# Altium schematic sheet bolid-inputs-digital.SchDoc
size A3
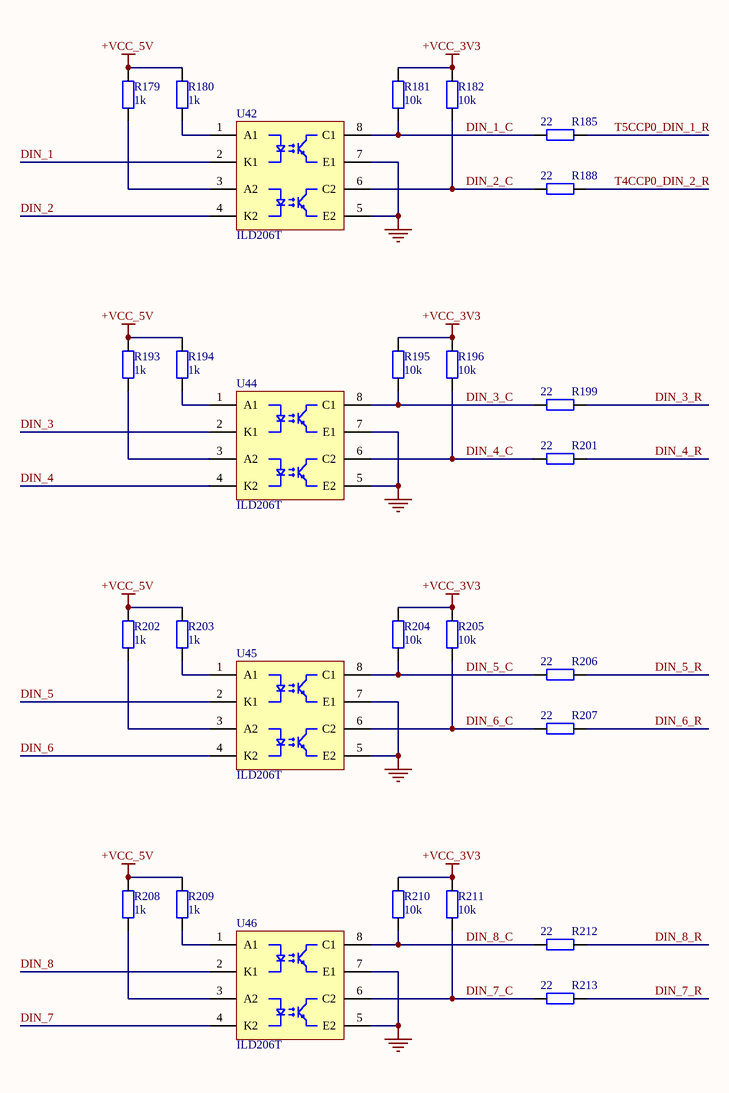
[diagram p0: bolid-inputs-digital.SchDoc]

## Parts
R179  value 1k  [R0402-RESC100X50X40L22N]  (hidden comment: RC0402FR-071KL)
R180  value 1k  [R0402-RESC100X50X40L22N]  (hidden comment: RC0402FR-071KL)
R181  value 10k  [R0402-RESC100X50X40L22N]  (hidden comment: RC0402FR-0710KL)
R182  value 10k  [R0402-RESC100X50X40L22N]  (hidden comment: RC0402FR-0710KL)
R185  value 22  [R0402-RESC100X50X40L22N]  (hidden comment: RC0402FR-1322RL)
R188  value 22  [R0402-RESC100X50X40L22N]  (hidden comment: RC0402FR-1322RL)
R193  value 1k  [R0402-RESC100X50X40L22N]  (hidden comment: RC0402FR-071KL)
R194  value 1k  [R0402-RESC100X50X40L22N]  (hidden comment: RC0402FR-071KL)
R195  value 10k  [R0402-RESC100X50X40L22N]  (hidden comment: RC0402FR-0710KL)
R196  value 10k  [R0402-RESC100X50X40L22N]  (hidden comment: RC0402FR-0710KL)
R199  value 22  [R0402-RESC100X50X40L22N]  (hidden comment: RC0402FR-1322RL)
R201  value 22  [R0402-RESC100X50X40L22N]  (hidden comment: RC0402FR-1322RL)
R202  value 1k  [R0402-RESC100X50X40L22N]  (hidden comment: RC0402FR-071KL)
R203  value 1k  [R0402-RESC100X50X40L22N]  (hidden comment: RC0402FR-071KL)
R204  value 10k  [R0402-RESC100X50X40L22N]  (hidden comment: RC0402FR-0710KL)
R205  value 10k  [R0402-RESC100X50X40L22N]  (hidden comment: RC0402FR-0710KL)
R206  value 22  [R0402-RESC100X50X40L22N]  (hidden comment: RC0402FR-1322RL)
R207  value 22  [R0402-RESC100X50X40L22N]  (hidden comment: RC0402FR-1322RL)
R208  value 1k  [R0402-RESC100X50X40L22N]  (hidden comment: RC0402FR-071KL)
R209  value 1k  [R0402-RESC100X50X40L22N]  (hidden comment: RC0402FR-071KL)
R210  value 10k  [R0402-RESC100X50X40L22N]  (hidden comment: RC0402FR-0710KL)
R211  value 10k  [R0402-RESC100X50X40L22N]  (hidden comment: RC0402FR-0710KL)
R212  value 22  [R0402-RESC100X50X40L22N]  (hidden comment: RC0402FR-1322RL)
R213  value 22  [R0402-RESC100X50X40L22N]  (hidden comment: RC0402FR-1322RL)
U42  ILD206T  [Vishay SOIC8 ILD SOIC8P127_600X610X395L51X41]
U44  ILD206T  [Vishay SOIC8 ILD SOIC8P127_600X610X395L51X41]
U45  ILD206T  [Vishay SOIC8 ILD SOIC8P127_600X610X395L51X41]
U46  ILD206T  [Vishay SOIC8 ILD SOIC8P127_600X610X395L51X41]

## Nets
+VCC_3V3: R181.2 R182.2 R195.2 R196.2 R204.2 R205.2 R210.2 R211.2
+VCC_5V: R179.2 R180.2 R193.2 R194.2 R202.2 R203.2 R208.2 R209.2
GND: U42.5(E2) U42.7(E1) U44.5(E2) U44.7(E1) U45.5(E2) U45.7(E1) U46.5(E2) U46.7(E1)
DIN_1: U42.2(K1)
DIN_1_C: R181.1 R185.1 U42.8(C1)
DIN_2: U42.4(K2)
DIN_2_C: R182.1 R188.1 U42.6(C2)
DIN_3: U44.2(K1)
DIN_3_C: R195.1 R199.1 U44.8(C1)
DIN_3_R: R199.2
DIN_4: U44.4(K2)
DIN_4_C: R196.1 R201.1 U44.6(C2)
DIN_4_R: R201.2
DIN_5: U45.2(K1)
DIN_5_C: R204.1 R206.1 U45.8(C1)
DIN_5_R: R206.2
DIN_6: U45.4(K2)
DIN_6_C: R205.1 R207.1 U45.6(C2)
DIN_6_R: R207.2
DIN_7: U46.4(K2)
DIN_7_C: R211.1 R213.1 U46.6(C2)
DIN_7_R: R213.2
DIN_8: U46.2(K1)
DIN_8_C: R210.1 R212.1 U46.8(C1)
DIN_8_R: R212.2
T4CCP0_DIN_2_R: R188.2
T5CCP0_DIN_1_R: R185.2
NetR179_1: R179.1 U42.3(A2)
NetR180_1: R180.1 U42.1(A1)
NetR193_1: R193.1 U44.3(A2)
NetR194_1: R194.1 U44.1(A1)
NetR202_1: R202.1 U45.3(A2)
NetR203_1: R203.1 U45.1(A1)
NetR208_1: R208.1 U46.3(A2)
NetR209_1: R209.1 U46.1(A1)

## Library data of the parts
R179 R180 R193 R194 R202 R203 R208 R209 = RC0402FR-071KL: RES 0402 (1005) 1.00k 1% 0.0625W 50V Thick Film; Manufacturer: Yageo; Power Rating: 62.5 mW, 125 mW; Resistance: 1 kOhms; Temperature Coefficient: 100 PPM / C; Supplier 1: Mouser; Manufacturer Part Number: RC0402FR-071KL; RoHS: RoHS Compliant; Category: Thick Film Resistors - SMD; Stock 1: 18776448; Pricing 1: 1=0.090, 10=0.011, 100=0.004, 1000=0.003, 10000=0.003 (EUR); Application: High Reliability; Features: -; Height: 0.35 mm; Length: 1 mm; Package / Case: -; Packaging: Cut Tape; Product: Thick Film Resistors SMD; Series: RC; Technology: Thick Film; Termination Style: SMD/SMT; Tolerance: 1 %; Type: General Purpose; Voltage Rating: 50 V; Width: 0.5 mm; Brand: Yageo; Mounting Style: PCB Mount; Case Code - in: 0402; Case Code - mm: 1005; Maximum Operating Temperature: + 155 C; Minimum Operating Temperature: - 55 C; Product Type: Thick Film Resistors; Standard Pack Qty: 10000; Subcategory: Resistors; RoHS - Mouser: Y; Minimum Order Quantity: 1; Reeling: True; ComponentLink1URL: https://www.mouser.com/datasheet/2/447/PYu-RC_Group_51_RoHS_L_10-1664068.pdf; ComponentLink1Description: https://www.mouser.com/datasheet/2/447/PYu-RC_Group_51_RoHS_L_10-1664068.pdf; Supplier Part Number 1: 603-RC0402FR-071KL
R181 R182 R195 R196 R204 R205 R210 R211 = RC0402FR-0710KL: RES 0402 (1005) 10.0k 1% 0.0625W 50V Thick Film; Manufacturer: Yageo; Power Rating: 62.5 mW, 125 mW; Resistance: 10 kOhms; Temperature Coefficient: 100 PPM / C; Supplier 1: Mouser; Manufacturer Part Number: RC0402FR-0710KL; RoHS: RoHS Compliant; Category: Thick Film Resistors - SMD; Stock 1: 20942447; Pricing 1: 1=0.090, 10=0.011, 100=0.004, 1000=0.003, 10000=0.003 (EUR); Application: High Reliability; Features: -; Height: 0.35 mm; Length: 1 mm; Package / Case: -; Packaging: Cut Tape; Product: Thick Film Resistors SMD; Series: RC; Technology: Thick Film; Termination Style: SMD/SMT; Tolerance: 1 %; Type: General Purpose; Voltage Rating: 50 V; Width: 0.5 mm; Brand: Yageo; Mounting Style: PCB Mount; Case Code - in: 0402; Case Code - mm: 1005; Maximum Operating Temperature: + 155 C; Minimum Operating Temperature: - 55 C; Product Type: Thick Film Resistors; Standard Pack Qty: 10000; Subcategory: Resistors; RoHS - Mouser: Y; Minimum Order Quantity: 1; Reeling: True; ComponentLink1URL: https://www.mouser.com/datasheet/2/447/PYu-RC_Group_51_RoHS_L_10-1664068.pdf; ComponentLink1Description: https://www.mouser.com/datasheet/2/447/PYu-RC_Group_51_RoHS_L_10-1664068.pdf; Supplier Part Number 1: 603-RC0402FR-0710KL
R185 R188 R199 R201 R206 R207 R212 R213 = RC0402FR-1322RL: RES 0402 (1005) 22.0 ohm 1% 0.0625W 50V Thick Film; Manufacturer: Yageo; Resistance: 22R; Power Rating: 62.5mW; Temperature Coefficient: 100ppm/°C; Supplier 1: Mouser; Manufacturer Part Number: RC0402FR-1322RL; RoHS: Yes; Category: Chip SMD Resistors; Stock 1: 130563; Pricing 1: 1=0,10000, 10=0,01200, 50=0,01200, 100=0,00500, 1000=0,00300, 10000=0,00300 (USD); Case/Package: 0402; Case Code (Imperial): 0402; Case Code (Metric): 1005; Weight: 2.3E-05oz; Contact Plating: Tin,Matte; Size Code: 0402; Min Operating Temperature: -55°C; Max Operating Temperature: 155°C; Voltage Rating: 50V; Tolerance: 1%; Packaging: Tape and Reel; Resistor Type: Thick Film; Termination: SMD/SMT; Series: RC; Length: 1mm; Width: 0.5mm; Height: 0.35mm; Radiation Hardening: No; Lead Free: Lead Free; RoHS Compliant: Yes; ComponentLink1URL: https://datasheet.ciiva.com/17423/pyu-rc0402-51-rohs-l-6-r-17423721.pdf?src-supplier=Future+Electronics; ComponentLink1Description: https://datasheet.ciiva.com/17423/pyu-rc0402-51-rohs-l-6-r-17423721.pdf?src-supplier=Future+Electronics; ComponentLink2URL: https://datasheet.ciiva.com/8890/pyu-rc0402-51-rohs-l-6-8890187.pdf?src-supplier=Avnet; ComponentLink2Description: https://datasheet.ciiva.com/8890/pyu-rc0402-51-rohs-l-6-8890187.pdf?src-supplier=Avnet; Supplier Part Number 1: 603-RC0402FR-1322RL
U42 U44-U46 = ILD206T: Transistor Output Optocouplers Phototransistor Out Dual CTR 63-125%; Manufacturer: Vishay Semiconductors; Configuration: 2 Channel; Isolation Voltage: 4000 Vrms; Output Type: NPN Phototransistor; Collector-Emitter Breakdown Voltage: 70 V; Current Transfer Ratio: 125 %; If - Forward Current: 30 mA; Maximum Collector Emitter Saturation Voltage: 0.4 V; Pd - Power Dissipation: 300 mW; Vf - Forward Voltage: 1.55 V; Vr - Reverse Voltage: 6 V; Supplier 1: Mouser; Manufacturer Part Number: ILD206T; RoHS: RoHS Compliant; Category: Transistor Output Optocouplers; Stock 1: 3481; Pricing 1: 1=1.22, 10=0.834, 100=0.625, 500=0.512, 1000=0.443, 2000=0.404, 4000=0.394 (EUR); Height: 3.38 mm; Length: 5.84 mm; Package / Case: SOIC-8; Packaging: Cut Tape; Width: 3.91 mm; Brand: Vishay Semiconductors; Mounting Style: SMD/SMT; Number of Channels: 2 Channel; Maximum Collector Emitter Voltage: 70 V; Maximum Operating Temperature: + 100 C; Minimum Operating Temperature: - 55 C; Product Type: Transistor Output Optocouplers; Standard Pack Qty: 2000; Subcategory: Optocouplers; RoHS - Mouser: Y; Minimum Order Quantity: 1; Reeling: True; ComponentLink1URL: https://www.mouser.com/datasheet/2/427/ild205t-244792.pdf; ComponentLink1Description: https://www.mouser.com/datasheet/2/427/ild205t-244792.pdf; Supplier Part Number 1: 782-ILD206T